# Altium schematic sheet Private_CPU_Sub_Power_Supplies.SchDoc
size D
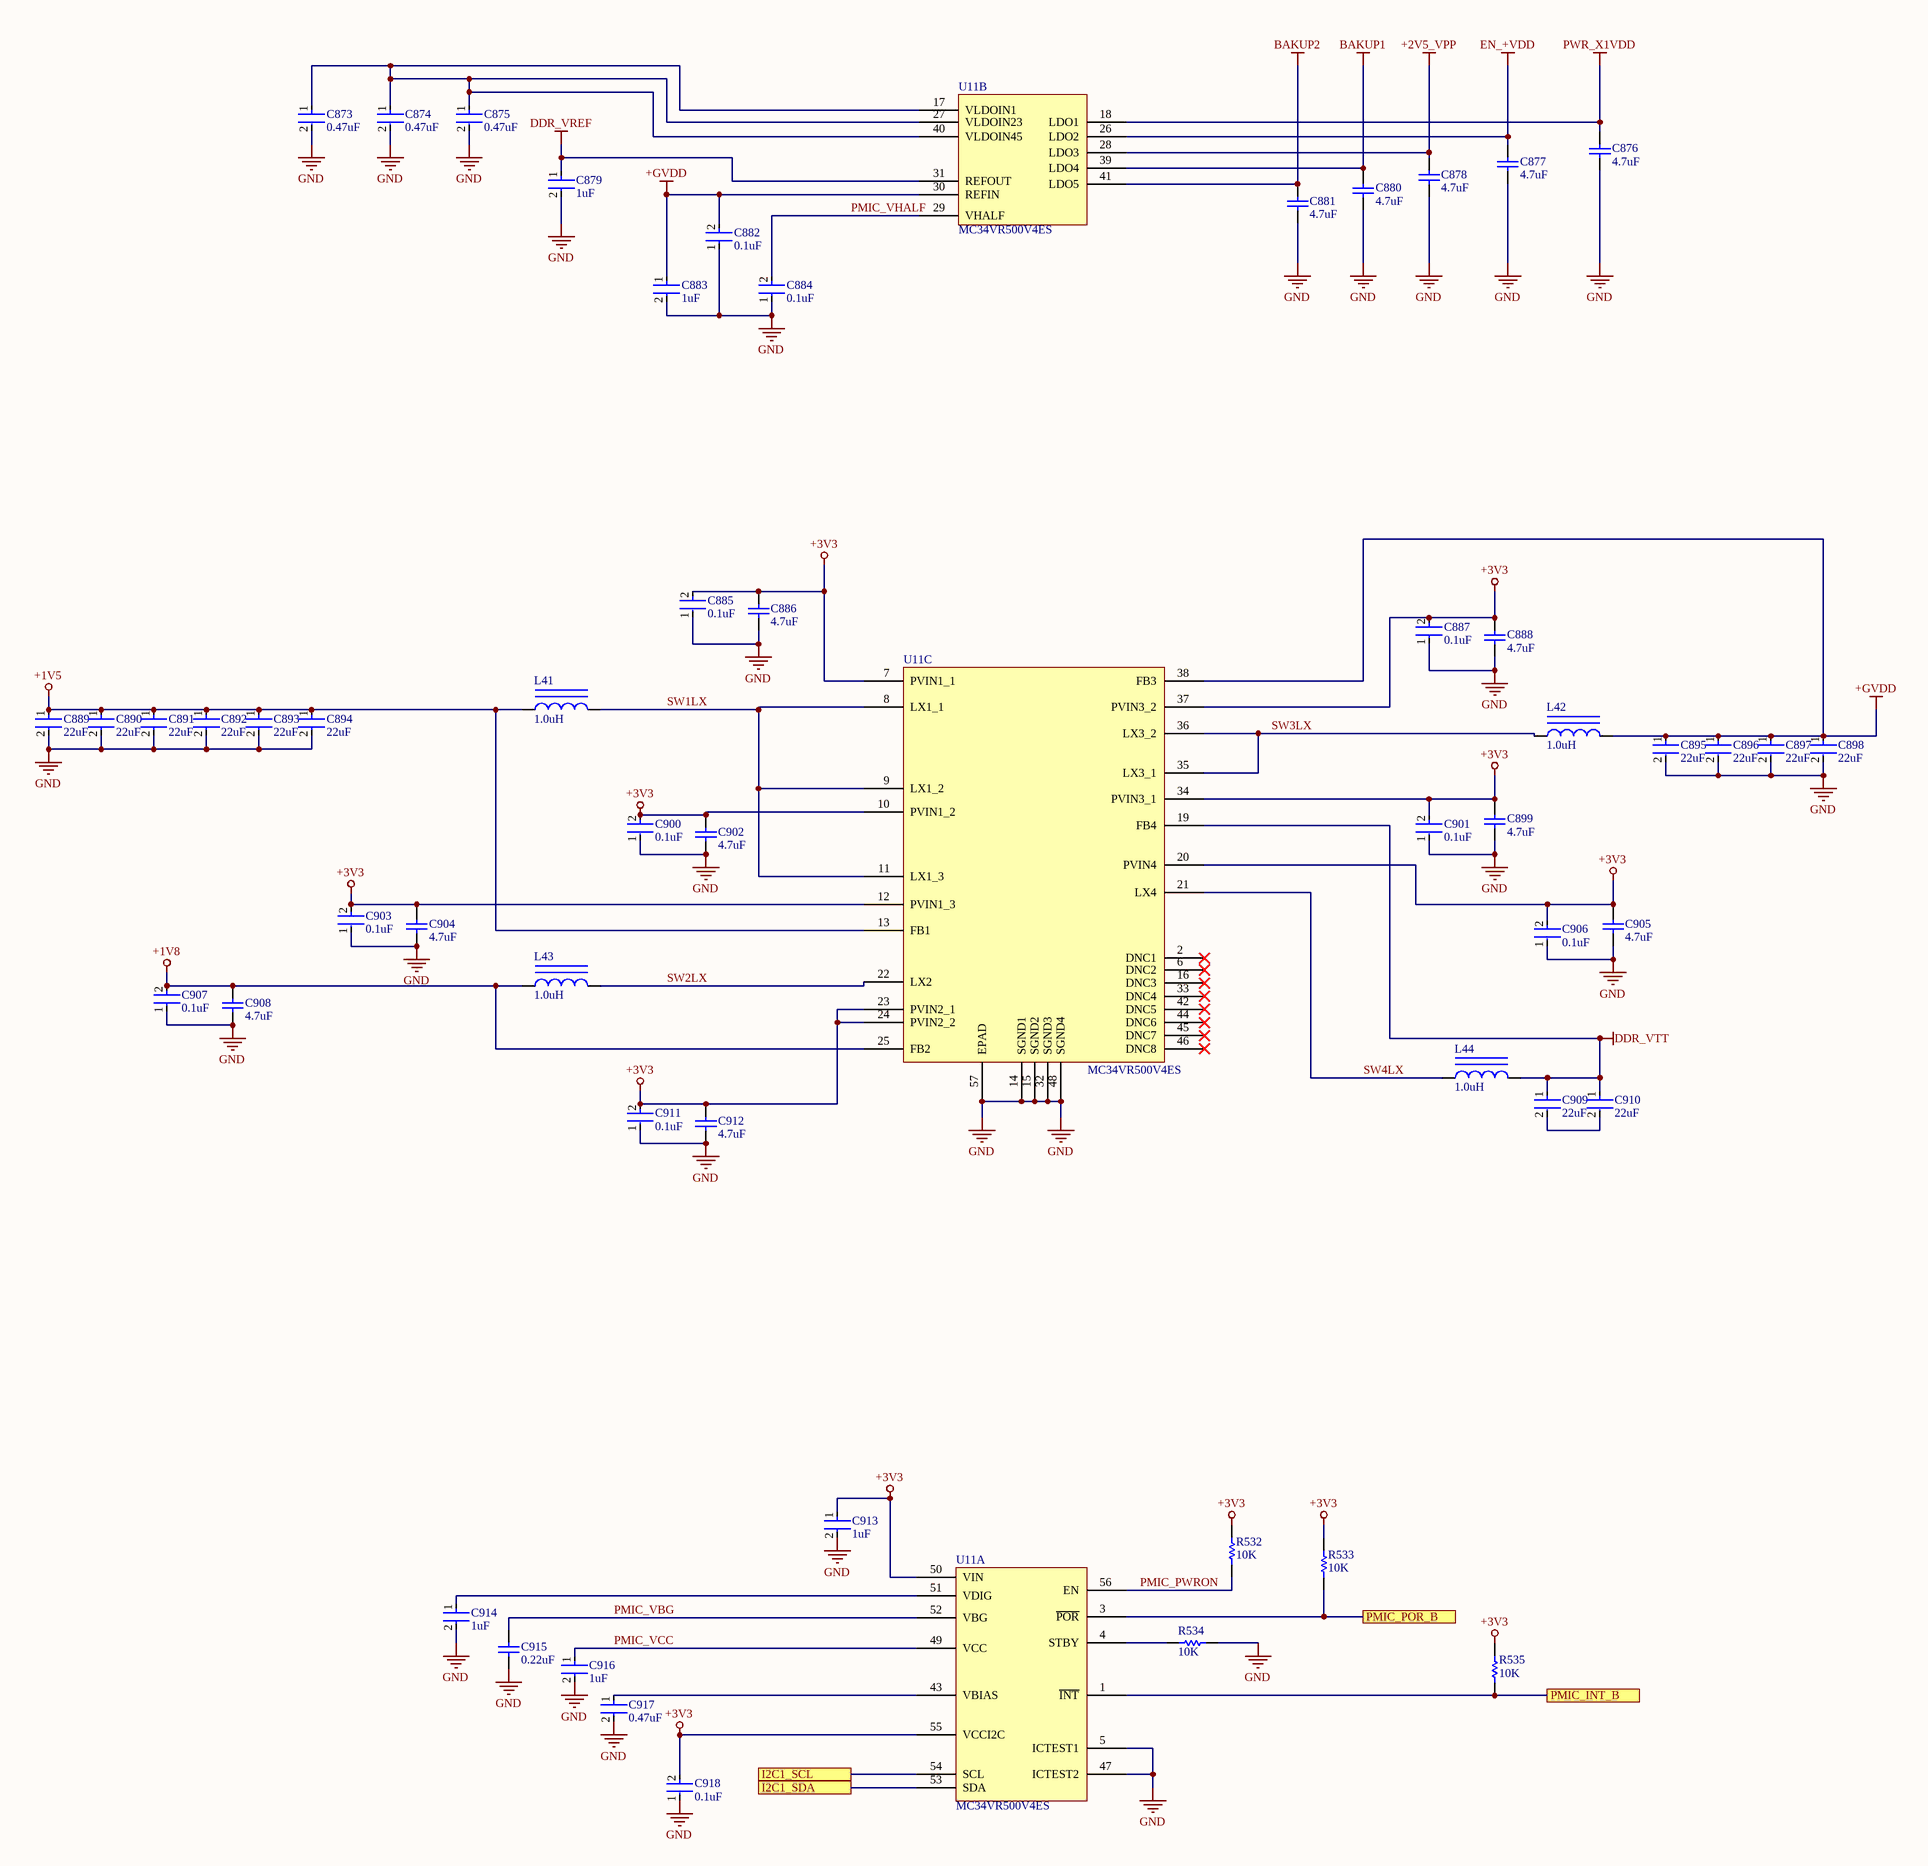
[diagram p0: Private_CPU_Sub_Power_Supplies.SchDoc]

## Parts
C873  0.47uF  [FP-GRM188-0_1-e0_2_0_5-IPC_B]
C874  0.47uF  [FP-GRM188-0_1-e0_2_0_5-IPC_B]
C875  0.47uF  [FP-GRM188-0_1-e0_2_0_5-IPC_B]
C876  4.7uF  [CAPC2013X145X50ML20T25]
C877  4.7uF  [CAPC2013X145X50ML20T25]
C878  4.7uF  [CAPC2013X145X50ML20T25]
C879  1uF  [FP-GRM15-0_1-MFG]
C880  4.7uF  [CAPC2013X145X50ML20T25]
C881  4.7uF  [CAPC2013X145X50ML20T25]
C882  0.1uF  [FP-GRM15-MFG]
C883  1uF  [FP-GRM15-0_1-MFG]
C884  0.1uF  [FP-GRM15-MFG]
C885  0.1uF  [FP-GRM15-MFG]
C886  4.7uF  [CAPC2013X145X50ML20T25]
C887  0.1uF  [FP-GRM15-MFG]
C888  4.7uF  [CAPC2013X145X50ML20T25]
C889  22uF  [FP-GRM21B-0_15-MFG]
C890  22uF  [FP-GRM21B-0_15-MFG]
C891  22uF  [FP-GRM21B-0_15-MFG]
C892  22uF  [FP-GRM21B-0_15-MFG]
C893  22uF  [FP-GRM21B-0_15-MFG]
C894  22uF  [FP-GRM21B-0_15-MFG]
C895  22uF  [FP-GRM21B-0_15-MFG]
C896  22uF  [FP-GRM21B-0_15-MFG]
C897  22uF  [FP-GRM21B-0_15-MFG]
C898  22uF  [FP-GRM21B-0_15-MFG]
C899  4.7uF  [CAPC2013X145X50ML20T25]
C900  0.1uF  [FP-GRM15-MFG]
C901  0.1uF  [FP-GRM15-MFG]
C902  4.7uF  [CAPC2013X145X50ML20T25]
C903  0.1uF  [FP-GRM15-MFG]
C904  4.7uF  [CAPC2013X145X50ML20T25]
C905  4.7uF  [CAPC2013X145X50ML20T25]
C906  0.1uF  [FP-GRM15-MFG]
C907  0.1uF  [FP-GRM15-MFG]
C908  4.7uF  [CAPC2013X145X50ML20T25]
C909  22uF  [FP-GRM21B-0_15-MFG]
C910  22uF  [FP-GRM21B-0_15-MFG]
C911  0.1uF  [FP-GRM15-MFG]
C912  4.7uF  [CAPC2013X145X50ML20T25]
C913  1uF  [FP-GRM15-0_1-MFG]
C914  1uF  [FP-GRM15-0_1-MFG]
C915  0.22uF  [CAPC1005X55X25NL05T10]
C916  1uF  [FP-GRM15-0_1-MFG]
C917  0.47uF  [FP-GRM188-0_1-e0_2_0_5-IPC_B]
C918  0.1uF  [FP-GRM15-MFG]
L41  1.0uH  [BOUR-CM45_L]
L42  1.0uH  [BOUR-CM45_L]
L43  1.0uH  [BOUR-CM45_L]
L44  1.0uH  [BOUR-CM45_L]
R532  10K  [RESC1005X40X25LL05T05]
R533  10K  [RESC1005X40X25LL05T05]
R534  10K  [RESC1005X40X25LL05T05]
R535  10K  [RESC1005X40X25LL05T05]
U11  MC34VR500V4ES  [QFN50P800X800X90-57N]  (parts A,B,C of 3)

## Ports
I2C1_SCL, I2C1_SDA, PMIC_INT_B, PMIC_POR_B

## Nets
+1V5: C889.1 C890.1 C891.1 C892.1 C893.1 C894.1 L41.1 U11.13(FB1)
+1V8: C907.2 C908.2 L43.1 U11.25(FB2)
+2V5_VPP: C878.2 U11.28(LDO3)
+3V3: C885.2 C886.2 C887.2 C888.2 C899.2 C900.2 C901.2 C902.2 C903.2 C904.2 C905.2 C906.2 C911.2 C912.2 C913.1 C918.2 R532.2 R533.2 R535.2 U11.7(PVIN1_1) U11.10(PVIN1_2) U11.12(PVIN1_3) U11.20(PVIN4) U11.23(PVIN2_1) U11.24(PVIN2_2) U11.34(PVIN3_1) U11.37(PVIN3_2) U11.50(VIN) U11.55(VCCI2C)
+GVDD: C882.2 C883.1 C895.1 C896.1 C897.1 C898.1 L42.2 U11.30(REFIN) U11.38(FB3)
BAKUP1: C880.2 U11.39(LDO4)
BAKUP2: C881.2 U11.41(LDO5)
DDR_VREF: C879.1 U11.31(REFOUT)
DDR_VTT: C909.1 C910.1 L44.2 U11.19(FB4)
EN_+VDD: C877.2 U11.26(LDO2)
GND: C873.2 C874.2 C875.2 C876.1 C877.1 C878.1 C879.2 C880.1 C881.1 C882.1 C883.2 C884.1 C885.1 C886.1 C887.1 C888.1 C889.2 C890.2 C891.2 C892.2 C893.2 C894.2 C895.2 C896.2 C897.2 C898.2 C899.1 C900.1 C901.1 C902.1 C903.1 C904.1 C905.1 C906.1 C907.1 C908.1 C911.1 C912.1 C913.2 C914.2 C915.1 C916.2 C917.2 C918.1 R534.1 U11.5(ICTEST1) U11.14(SGND1) U11.15(SGND2) U11.32(SGND3) U11.47(ICTEST2) U11.48(SGND4) U11.57(EPAD)
PWR_X1VDD: C876.2 U11.18(LDO1)
I2C1_SCL: U11.54(SCL) ; port I2C1_SCL
I2C1_SDA: U11.53(SDA) ; port I2C1_SDA
PMIC_INT_B: R535.1 U11.1(~{INT}) ; port PMIC_INT_B
PMIC_POR_B: R533.1 U11.3(~{POR}) ; port PMIC_POR_B
PMIC_PWRON: R532.1 U11.56(EN)
PMIC_VBG: C915.2 U11.52(VBG)
PMIC_VCC: C916.1 U11.49(VCC)
PMIC_VHALF: C884.2 U11.29(VHALF)
SW1LX: L41.2 U11.8(LX1_1) U11.9(LX1_2) U11.11(LX1_3)
SW2LX: L43.2 U11.22(LX2)
SW3LX: L42.1 U11.35(LX3_1) U11.36(LX3_2)
SW4LX: L44.1 U11.21(LX4)
NetC873_1: C873.1 C874.1 C875.1 U11.17(VLDOIN1) U11.27(VLDOIN23) U11.40(VLDOIN45)
NetC909_2: C909.2 C910.2
NetC914_1: C914.1 U11.51(VDIG)
NetC917_1: C917.1 U11.43(VBIAS)
NetR534_2: R534.2 U11.4(STBY)

Not connected (* = marked no-connect by the designer): U11 2(DNC1)* 6(DNC2)* 16(DNC3)* 33(DNC4)* 42(DNC5)* 44(DNC6)* 45(DNC7)* 46(DNC8)*

## Notes on the sheet
- Title
- Size:
- Date:
- File:
- D
- Number:
- Time:
- Revision:
- Sheet
- of

## Library data of the parts
C873-C875 C917 = CMP-2006-02860-2: Chip Multilayer Ceramic Capacitors for General Purpose, 0603, 0.47uF, X7R, 15%, 10%, 16V; Capacitance: 470nF; Material: Ceramic; Termination: SMD/SMT; Case Code (Imperial): 0603; Height: 0.8mm; Dielectric: X7R; Length: 1.6mm; Packaging: Tape and Reel; Mount: Surface Mount; Thickness: 0.035inch; Voltage Rating (DC): 16V; Case Code (Metric): 1608; REACH SVHC: No SVHC; Depth: 0.8mm; Number of Pins: 2; Max Operating Temperature: 125°C; Min Operating Temperature: -55°C; Width: 0.8mm; Voltage: 16V; Lead Free: Lead Free; Voltage Rating: 16V; Package Quantity: 1; Case/Package: 0603; Tolerance: 10%
C876-C878 C880 C881 C886 C888 C899 C902 C904 C905 C908 C912 = CMP-2007-01010-1: Manufacturer: Kemet; Part Number: C0805C475K3PACTU
C879 C883 C913 C914 C916 = CMP-2008-04556-2: CAP CER 1UF 10V X5R 0402; Manufacturer Part Number: GRM155R61A105KE15D; Manufacturer: Murata; Material: Ceramic; Tolerance: 10%; Temperature Coefficient: 15%; Octopart: https://octopart.com/grm155r61a105ke15d-murata-197442; Lead Free: Yes; ComponentLink2Description: Datasheet; Temperature: -55°C to +85°C; Temperature Range High: +85°C; Height: 0.55mm; Capacitance: 1uF; Ipc Land Pattern Name: CAPC10050X50; ComponentLink2URL: https://search.murata.co.jp/Ceramy/image/img/A01X/G101/ENG/GRM155R61A105KE15-01A.pdf; Temperature Range Low: -55°C; Device Class L2: Capacitors; Voltage Rating: 10V; RoHS: TRUE; Device Class L1: Passive Components; Device Class L3: Ceramic Capacitors; Temperature Characteristic: X5R; Mouser Description: 0402 1 uF 10 V ±10% Tolerance X5R Surface Mount Multilayer Ceramic Capacitor; Automotive: No; Package: GRM15-0.1; Digikey Description: CAP CER 1UF 10V X5R 0402; Value: 1uF; Category: Cap
C882 C884 C885 C887 C900 C901 C903 C906 C907 C911 C918 = CMP-2100-03641-2: CAP CER 0.1UF 16V X7R 0402; Manufacturer Part Number: GRM155R71C104KA88D; Manufacturer: Murata; Standoff Height: 0mm; Tolerance: 10%; Voltage Rating: 16Vdc; Material: Ceramic; Capacitance: 0.10μF; Value: 0.10μF; RoHS: TRUE; Temperature Characteristic: X7R; Octopart: https://octopart.com/grm155r71c104ka88d-murata-196880; Digikey Description: CAP CER 0.1UF 16V X7R 0402; Device Class L3: Ceramic Capacitors; Height: 0.55mm; ComponentLink2Description: Datasheet; Temperature Range Low: -55°C; Ipc Land Pattern Name: CAPC10050X219; ComponentLink2URL: https://search.murata.co.jp/Ceramy/image/img/A01X/G101/ENG/GRM155R71H471KA01-01A.pdf; Device Class L1: Passive Components; Lead Free: yes; Category: Cap; Package: GRM15; Temperature: -55°C to +125°C; Device Class L2: Capacitors; Temperature Range High: +125°C; Mouser Description: 0402 0.1 uF 16V ±10 % Tolerance X7R SMT Multilayer Ceramic Capacitor
C889-C898 C909 C910 = CMP-2007-03385-2: Chip Multilayer Ceramic Capacitors for General Purpose, 0805, 22uF, X5R, 15%, 20%, 6.3V; Material: Ceramic; Max Operating Temperature: 85°C; Voltage: 6.3V; Min Operating Temperature: -55°C; Case/Package: 0805; Thickness: 0.053inch; Dielectric: X5R; Packaging: Tape and Reel; Depth: 1.25mm; Termination: SMD/SMT; Voltage Rating (DC): 6.3V; Radiation Hardening: No; Tolerance: 20%; Mount: Surface Mount; Lead Free: Lead Free; Package Quantity: 1; REACH SVHC: No SVHC; Voltage Rating: 6.3V; Capacitance: 22uF; Length: 2mm; Case Code (Imperial): 0805; Case Code (Metric): 2012; Width: 0.049inch; Height: 1.25mm
C915 = CMP-2008-04561-4: Chip Capacitor, 220 nF, +/- 10%, 10 V, -55 to 85 degC, 0402 (1005 Metric), RoHS, Tape and Reel; Manufacturer: Basic Passives; PartNumber: GRM155R61A224KE19D; Case\/Package: 0402; Voltage Rating: 10 V; Type (Capacitors): X5R; Capacitance: 220 nF; Max Operating Temperature: 85 degC; Package Quantity: 1; RoHSCompliant: true; Height: 0.5 mm; Mounting Technology: Surface Mount; Case Code (Metric): 1005; ComponentLink2URL: http://search.murata.co.jp/Ceramy/image/img/A01X/G101/ENG/GRM155R61A224KE19-01.pdf; Case Code (Imperial): 0402; Length: 1 mm; Radiation Hardening: No; Tolerance: 10%; Pins: 2; ComponentLink1Description: Manufacturer URL; Voltage Rating (DC): 10 V; Width: 0.5 mm; REACH SVHC: No SVHC; ComponentLink1URL: http://www.murata.com/; Min Operating Temperature: -55 degC; DatasheetVersion: 03/2016; Mount: Surface Mount; PackageReference: 0402; Packaging: Tape and Reel; ComponentLink2Description: Datasheet; PackageDescription: 2-Pin Surface Mount Device, Body 1 x 0.5 mm
L41-L44 = CMP-2000-06114-1: Chip Inductor, 1 uH, +/- 10%, 450 mA, -40 to 125 degC, 2-Pin SMD (1812), RoHS, Tape and Reel; Manufacturer: Bourns; Nominal inductivity: 1µH; Content: 1pc(s); Nominal current: 0.45A; Type: CM453232-1R0KL; Category: Inductor; Package Description: 2-Pin Surface Mount Device, Body 4.5 x 3.2 mm; Manufacturer URL: http://www.bourns.com/; LN: 1µH; Package Reference: CM45; Mounting Technology: SurfaceMount; Datasheet URL: http://www.bourns.com/docs/Product-Datasheets/cm.pdf; Datasheet Version: 03/2016
R532-R535 = CMP-2000-07588-1: Chip Resistor, 10 KOhm, +/- 1%, 0.1 W, -55 to 155 degC, 0402 (1005 Metric), RoHS, Tape and Reel; Manufacturer: Panasonic; Power Rating: 100mW; Voltage Rating: 50V; Resistance: 10KOhm; Case\/Package: 0402; Temperature Coefficient: 100ppm\/degreesC; RoHSCompliant: True; Lead Free: LeadFree; Package Quantity: 1; Contact Plating: Tin; Length: 1mm; Radiation Hardening: No; REACH SVHC: NoSVHC; Max Operating Temperature: 155degC; Depth: 0.5mm; Case Code (Imperial): 0402; Military Standard: Not; Package Description: 2-Pin Surface Mount Device, Body 1 x 0.5 mm; Termination: SMD/SMT; Case Code (Metric): 1005; Height: 0.35mm; Packaging: TapeandReel; Voltage Rating (DC): 50V; Package Reference: 402; Number of Pins: 2; Tolerance: 1%; Mounting Technology: SurfaceMount; Width: 0.02inch; Mount: SurfaceMount; Datasheet URL: https://industrial.panasonic.com/cdbs/www-data/pdf/RDA0000/AOA0000C304.pdf; Composition: ThickFilm; Datasheet Version: 02/2017; Manufacturer URL: http://www.panasonic.com/; Max Power Dissipation: 100mW; Number of Terminations: 2; Min Operating Temperature: -55degC
U11 = MC34VR500V4ES: Regulator, Buck, Quad with up to 4.5A Output and Triple User-programmable LDOs, QFN 56, Tray; MF: {'manufacturer': u'NXP Semiconductors'}; Package: None; MP: MC34VR500V4ES; Value: *; Availability: Unavailable; Price: None